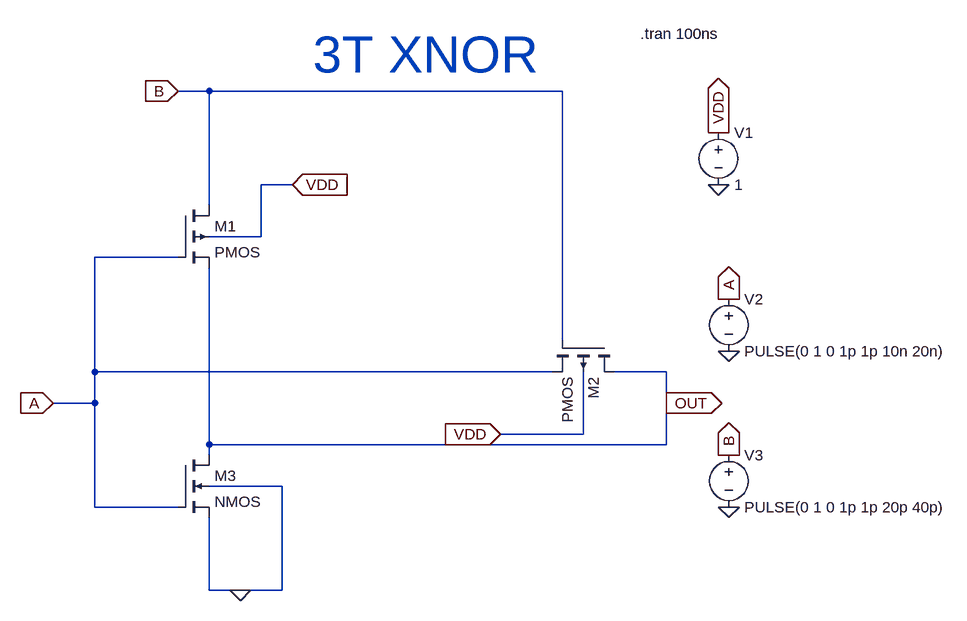
[diagram p0: schematic 3T XNOR.asc]
3T XNOR.asc, the LTspice schematic file:
Version 4
SHEET 1 1400 752
WIRE 256 -32 208 -32
WIRE 800 -32 256 -32
WIRE 384 112 336 112
WIRE 256 144 256 -32
WIRE 336 192 336 112
WIRE 336 192 256 192
WIRE 208 224 80 224
WIRE 800 352 800 -32
WIRE 80 400 80 224
WIRE 784 400 80 400
WIRE 960 400 880 400
WIRE 80 448 80 400
WIRE 80 448 16 448
WIRE 960 448 960 400
WIRE 832 496 832 400
WIRE 832 496 704 496
WIRE 256 512 256 240
WIRE 960 512 960 448
WIRE 960 512 256 512
WIRE 256 528 256 512
WIRE 368 576 256 576
WIRE 80 608 80 448
WIRE 208 608 80 608
WIRE 256 736 256 624
WIRE 304 736 256 736
WIRE 368 736 368 576
WIRE 368 736 304 736
FLAG 704 496 VDD
IOPIN 704 496 In
FLAG 384 112 VDD
IOPIN 384 112 In
FLAG 1040 112 0
FLAG 1056 368 0
FLAG 1056 608 0
FLAG 1056 528 B
IOPIN 1056 528 Out
FLAG 1056 288 A
IOPIN 1056 288 Out
FLAG 1040 32 VDD
IOPIN 1040 32 Out
FLAG 960 448 OUT
IOPIN 960 448 Out
FLAG 208 -32 B
IOPIN 208 -32 In
FLAG 16 448 A
IOPIN 16 448 In
FLAG 304 736 0
SYMBOL pmos4 208 144 R0
SYMATTR InstName M1
SYMBOL pmos4 880 352 R90
SYMATTR InstName M2
SYMBOL nmos4 208 528 R0
SYMATTR InstName M3
SYMBOL voltage 1040 16 R0
SYMATTR InstName V1
SYMATTR Value 1
SYMBOL voltage 1056 272 R0
SYMATTR InstName V2
SYMATTR Value PULSE(0 1 0 1p 1p 10n 20n)
SYMBOL voltage 1056 512 R0
SYMATTR InstName V3
SYMATTR Value PULSE(0 1 0 1p 1p 20p 40p)
TEXT 920 -120 Left 2 !.tran 100ns
TEXT 416 -88 Left 6 ;3T XNOR

The netlist it stands for:
* 3T XNOR.asc
M1 B A OUT VDD PMOS
M2 OUT B A VDD PMOS
M3 OUT A 0 0 NMOS
V1 VDD 0 1
V2 A 0 PULSE(0 1 0 1p 1p 10n 20n)
V3 B 0 PULSE(0 1 0 1p 1p 20p 40p)
.model NMOS NMOS
.model PMOS PMOS
.lib standard.mos
.tran 100ns
* 3T XNOR
.backanno
.end